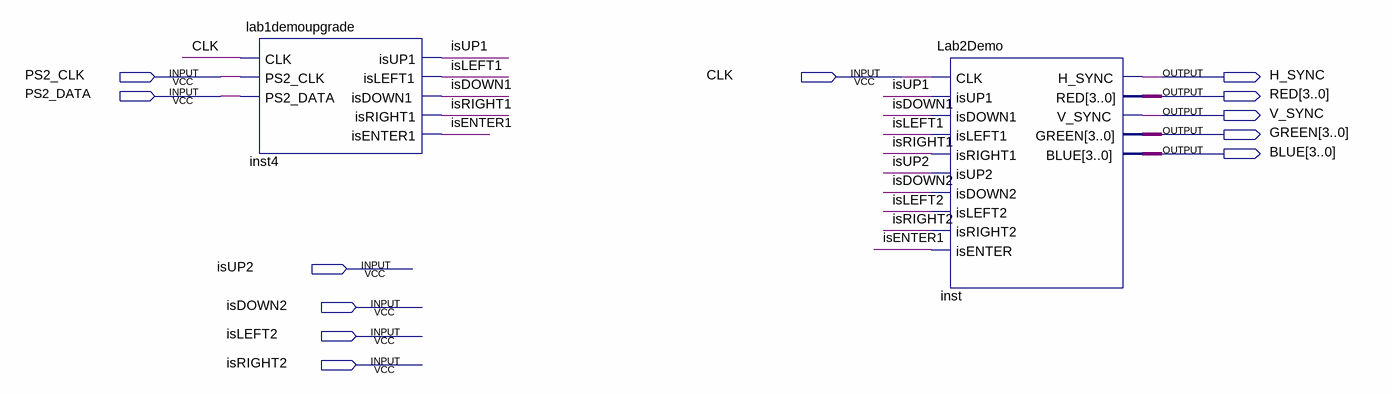
[diagram p0: schematic sheet]
// Quartus schematic Plocica1.bdf as structural Verilog: 2 symbols, 12 pins
module Plocica1 (
  input  PS2_CLK,
  input  CLK,
  input  PS2_DATA,
  input  isUP2,
  input  isDOWN2,
  input  isLEFT2,
  input  isRIGHT2,
  output H_SYNC,
  output [3:0] RED,
  output V_SYNC,
  output [3:0] GREEN,
  output [3:0] BLUE
);

  wire isDOWN1, isENTER1, isLEFT1, isRIGHT1, isUP1;

  lab1demoupgrade inst4 (
    .CLK(CLK), .PS2_CLK(PS2_CLK), .PS2_DATA(PS2_DATA), .isUP1(isUP1), .isLEFT1(isLEFT1), .isDOWN1(isDOWN1),
    .isRIGHT1(isRIGHT1), .isENTER1(isENTER1));
  Lab2Demo inst (
    .CLK(CLK), .isUP1(isUP1), .isDOWN1(isDOWN1), .isLEFT1(isLEFT1), .isRIGHT1(isRIGHT1), .isUP2(isUP2),
    .isDOWN2(isDOWN2), .isLEFT2(isLEFT2), .isRIGHT2(isRIGHT2), .isENTER(isENTER1), .H_SYNC(H_SYNC),
    .RED(RED), .V_SYNC(V_SYNC), .GREEN(GREEN), .BLUE(BLUE));
endmodule
